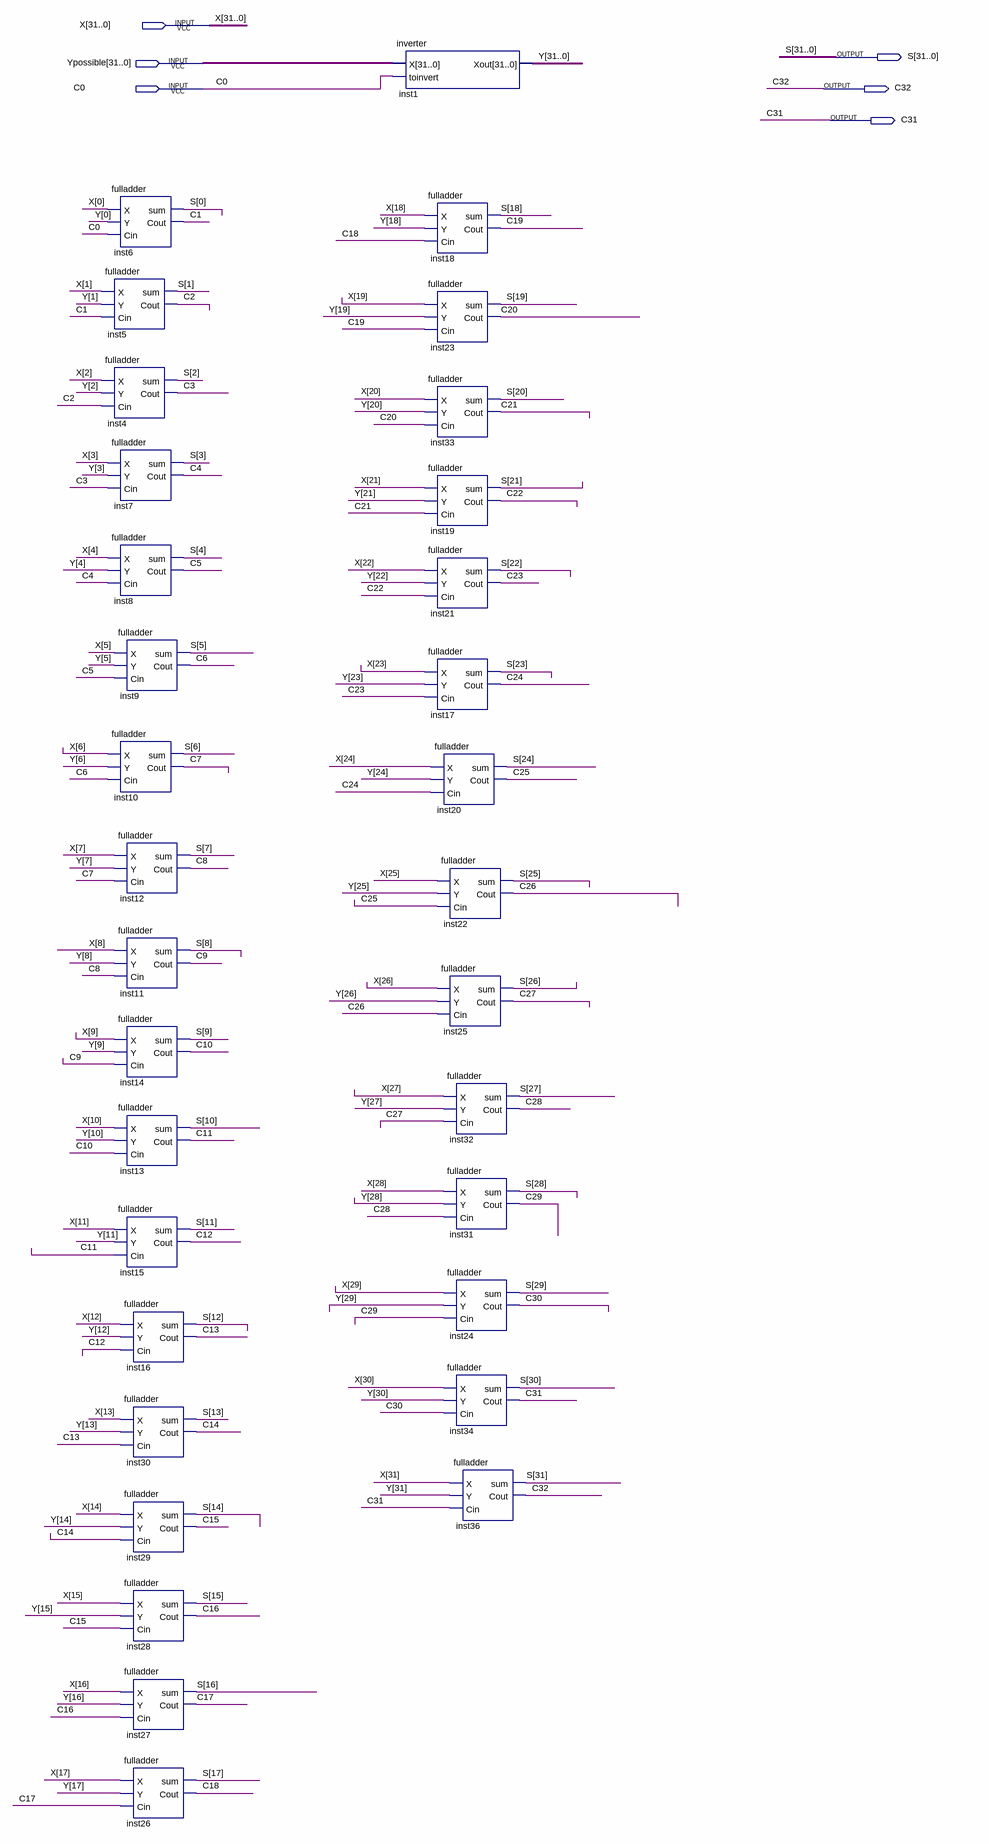
[diagram p0: schematic sheet]
// Quartus schematic adder.bdf as structural Verilog: 33 symbols, 6 pins
module adder (
  input  [31:0] X,
  input  [31:0] Ypossible,
  input  C0,
  output [31:0] S,
  output C32,
  output C31
);

  wire C1, C2, C3, C4, C5, C6, C7, C8, C9, C10, C11, C12, C13, C14, C15, C16, C17, C18, C19, C20, C21, C22,
       C23, C24, C25, C26, C27, C28, C29, C30;
  wire [31:0] Y;

  fulladder inst6 (.X(X[0]), .Y(Y[0]), .Cin(C0), .sum(S[0]), .Cout(C1));
  fulladder inst5 (.X(X[1]), .Y(Y[1]), .Cin(C1), .sum(S[1]), .Cout(C2));
  fulladder inst4 (.X(X[2]), .Y(Y[2]), .Cin(C2), .sum(S[2]), .Cout(C3));
  fulladder inst7 (.X(X[3]), .Y(Y[3]), .Cin(C3), .sum(S[3]), .Cout(C4));
  fulladder inst8 (.X(X[4]), .Y(Y[4]), .Cin(C4), .sum(S[4]), .Cout(C5));
  fulladder inst9 (.X(X[5]), .Y(Y[5]), .Cin(C5), .sum(S[5]), .Cout(C6));
  fulladder inst10 (.X(X[6]), .Y(Y[6]), .Cin(C6), .sum(S[6]), .Cout(C7));
  fulladder inst12 (.X(X[7]), .Y(Y[7]), .Cin(C7), .sum(S[7]), .Cout(C8));
  fulladder inst11 (.X(X[8]), .Y(Y[8]), .Cin(C8), .sum(S[8]), .Cout(C9));
  fulladder inst14 (.X(X[9]), .Y(Y[9]), .Cin(C9), .sum(S[9]), .Cout(C10));
  fulladder inst13 (.X(X[10]), .Y(Y[10]), .Cin(C10), .sum(S[10]), .Cout(C11));
  fulladder inst15 (.X(X[11]), .Y(Y[11]), .Cin(C11), .sum(S[11]), .Cout(C12));
  fulladder inst16 (.X(X[12]), .Y(Y[12]), .Cin(C12), .sum(S[12]), .Cout(C13));
  fulladder inst30 (.X(X[13]), .Y(Y[13]), .Cin(C13), .sum(S[13]), .Cout(C14));
  fulladder inst29 (.X(X[14]), .Y(Y[14]), .Cin(C14), .sum(S[14]), .Cout(C15));
  fulladder inst28 (.X(X[15]), .Y(Y[15]), .Cin(C15), .sum(S[15]), .Cout(C16));
  fulladder inst27 (.X(X[16]), .Y(Y[16]), .Cin(C16), .sum(S[16]), .Cout(C17));
  fulladder inst26 (.X(X[17]), .Y(Y[17]), .Cin(C17), .sum(S[17]), .Cout(C18));
  inverter inst1 (.X(Ypossible), .toinvert(C0), .Xout(Y));
  fulladder inst18 (.X(X[18]), .Y(Y[18]), .Cin(C18), .sum(S[18]), .Cout(C19));
  fulladder inst23 (.X(X[19]), .Y(Y[19]), .Cin(C19), .sum(S[19]), .Cout(C20));
  fulladder inst33 (.X(X[20]), .Y(Y[20]), .Cin(C20), .sum(S[20]), .Cout(C21));
  fulladder inst19 (.X(X[21]), .Y(Y[21]), .Cin(C21), .sum(S[21]), .Cout(C22));
  fulladder inst21 (.X(X[22]), .Y(Y[22]), .Cin(C22), .sum(S[22]), .Cout(C23));
  fulladder inst17 (.X(X[23]), .Y(Y[23]), .Cin(C23), .sum(S[23]), .Cout(C24));
  fulladder inst20 (.X(X[24]), .Y(Y[24]), .Cin(C24), .sum(S[24]), .Cout(C25));
  fulladder inst22 (.X(X[25]), .Y(Y[25]), .Cin(C25), .sum(S[25]), .Cout(C26));
  fulladder inst25 (.X(X[26]), .Y(Y[26]), .Cin(C26), .sum(S[26]), .Cout(C27));
  fulladder inst32 (.X(X[27]), .Y(Y[27]), .Cin(C27), .sum(S[27]), .Cout(C28));
  fulladder inst31 (.X(X[28]), .Y(Y[28]), .Cin(C28), .sum(S[28]), .Cout(C29));
  fulladder inst24 (.X(X[29]), .Y(Y[29]), .Cin(C29), .sum(S[29]), .Cout(C30));
  fulladder inst34 (.X(X[30]), .Y(Y[30]), .Cin(C30), .sum(S[30]), .Cout(C31));
  fulladder inst36 (.X(X[31]), .Y(Y[31]), .Cin(C31), .sum(S[31]), .Cout(C32));
endmodule
